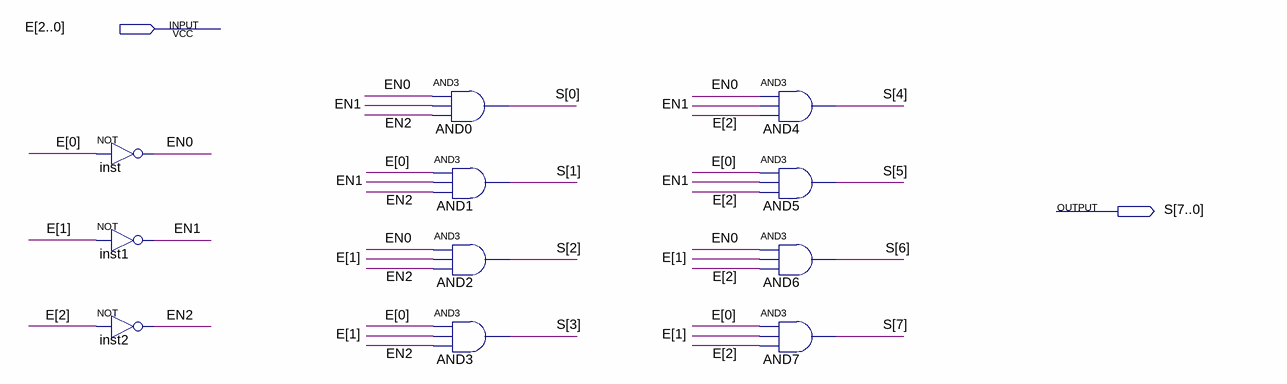
[diagram p0: schematic sheet]
// Quartus schematic DEC_3_8.bdf as structural Verilog: 11 symbols, 2 pins
module DEC_3_8 (
  input  [2:0] E,
  output [7:0] S
);

  wire EN0, EN1, EN2;

  not inst (EN0, E[0]);
  not inst1 (EN1, E[1]);
  not inst2 (EN2, E[2]);
  and AND0 (S[0], EN0, EN1, EN2);
  and AND1 (S[1], E[0], EN1, EN2);
  and AND2 (S[2], EN0, E[1], EN2);
  and AND3 (S[3], E[0], E[1], EN2);
  and AND4 (S[4], EN0, EN1, E[2]);
  and AND5 (S[5], E[0], EN1, E[2]);
  and AND6 (S[6], EN0, E[1], E[2]);
  and AND7 (S[7], E[0], E[1], E[2]);
endmodule
